# EAGLE design Adafruit OLED 128x32 Mono I2C (EAGLE 6.2)
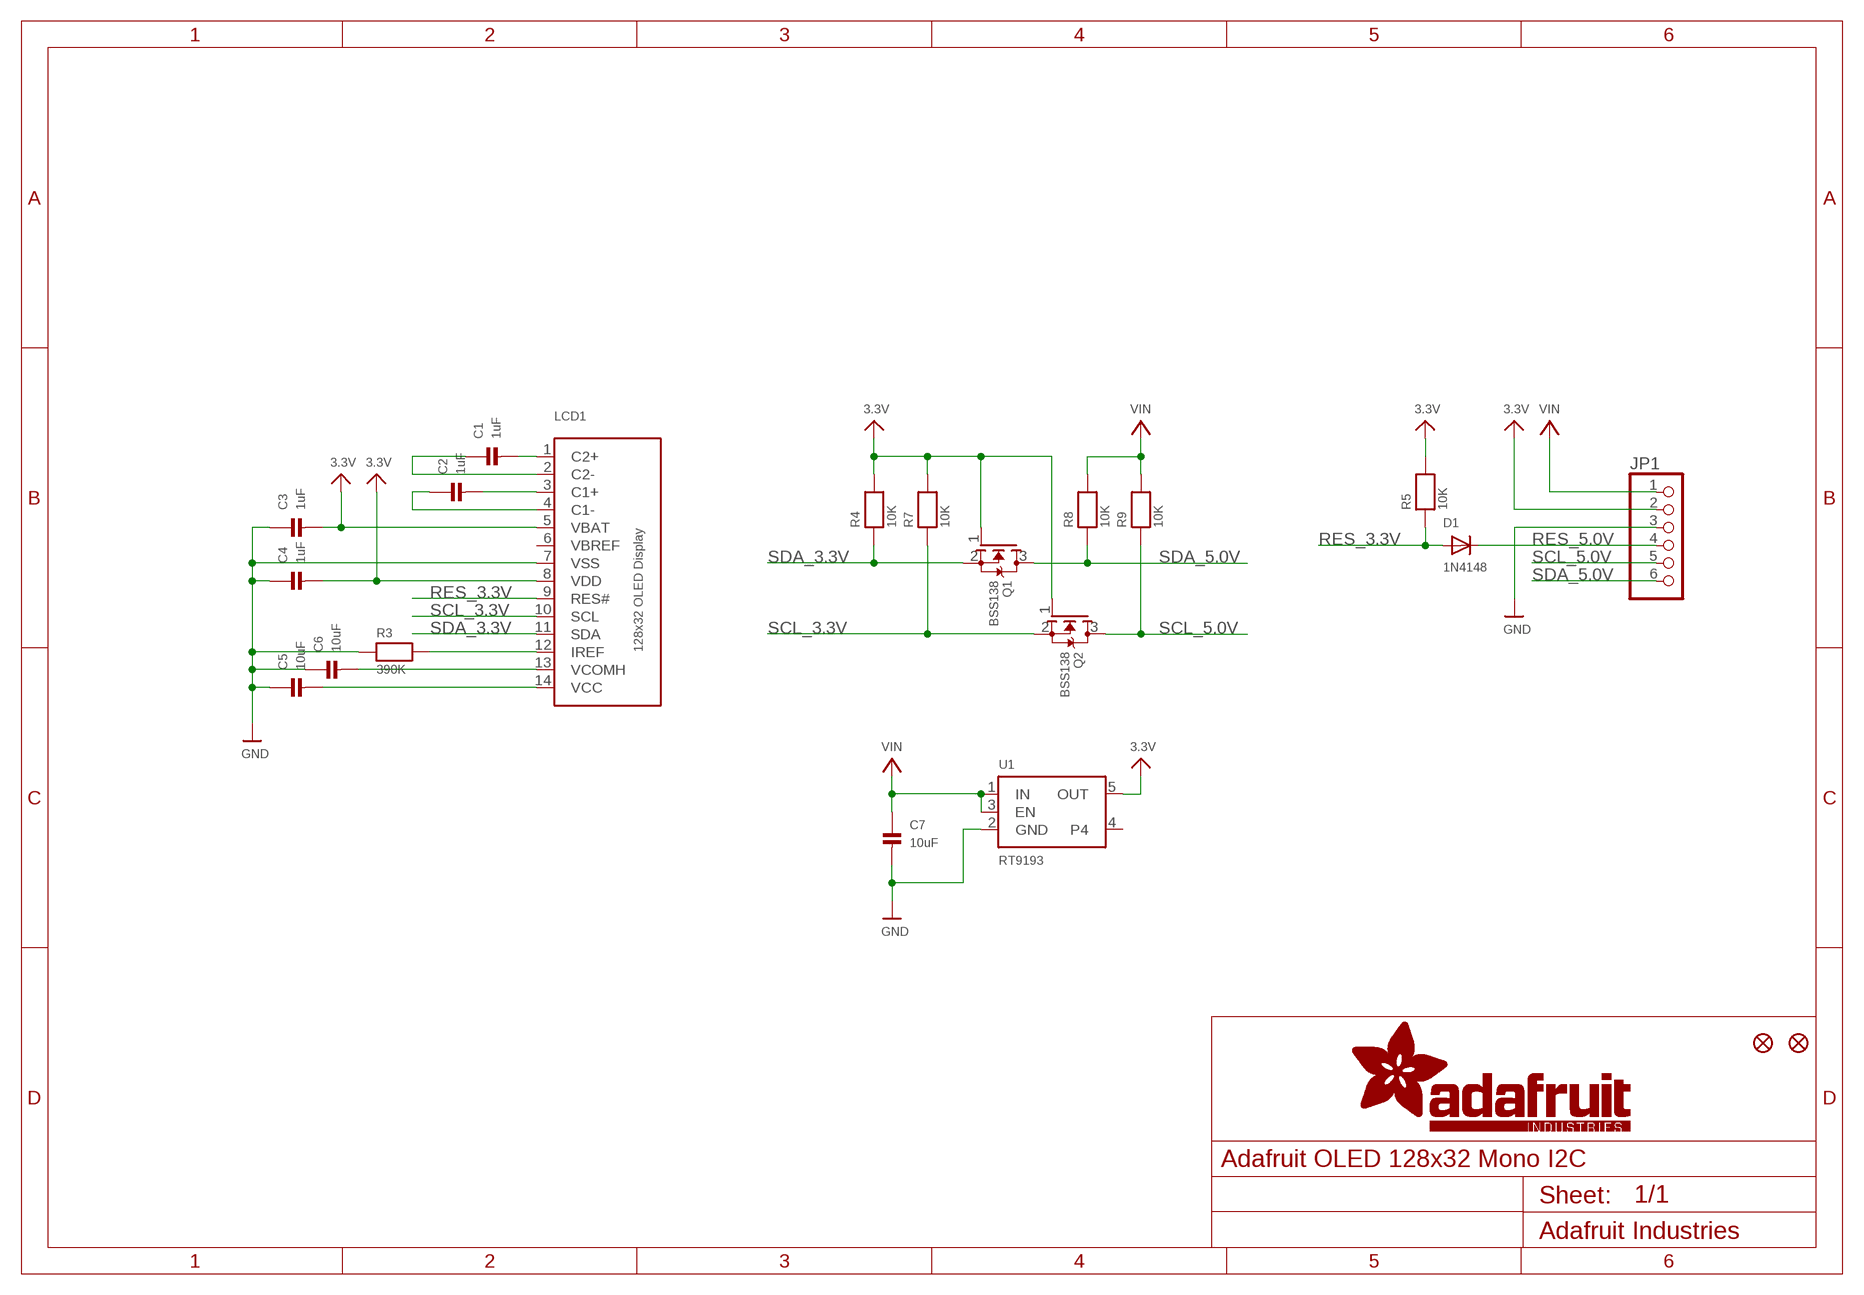
[diagram p0: schematic, sheet 1]

## Parts
C1  1uF  CAP_CERAMIC0805  [0805]
C2  1uF  CAP_CERAMIC0805  [0805]
C3  1uF  CAP_CERAMIC0805  [0805]
C4  1uF  CAP_CERAMIC0805  [0805]
C5  10uF  CAP_CERAMIC0805  [0805]
C6  10uF  CAP_CERAMIC0805  [0805]
C7  10uF  CAP_CERAMIC0805  [0805]
D1  1N4148  DIODESOD-323F  [SOD-323F]
FID1  FIDUCIAL""  [FIDUCIAL_1MM]
FID2  FIDUCIAL""  [FIDUCIAL_1MM]
JP1  HEADER-1X670MIL  [1X06_ROUND_70]
LCD1  DISP_OLED_UG-2832HSWEG02  [UG-2832HSWEG02_WRAPUNDER]
Q1  BSS138  MOSFET-NWIDE  [SOT23-WIDE]
Q2  BSS138  MOSFET-NWIDE  [SOT23-WIDE]
R3  390K  RESISTOR0805  [0805]
R4  10K  RESISTOR0805  [0805]
R5  10K  RESISTOR0805  [0805]
R7  10K  RESISTOR0805  [0805]
R8  10K  RESISTOR0805  [0805]
R9  10K  RESISTOR0805  [0805]
U1  RT9193  VREG_SOT23-5  [SOT23-5]

## Nets
3.3V: C3.2 C4.2 JP1.2 LCD1.5(VBAT) LCD1.8(VDD) Q1.1(G) Q2.1(G) R4.2 R5.2 R7.2 U1.5(OUT)
GND: C3.1 C4.1 C5.1 C6.1 C7.2 JP1.3 LCD1.7(VSS) R3.1 U1.2(GND)
N$1: C1.2 LCD1.1(C2+)
N$2: C1.1 LCD1.2(C2-)
N$3: C2.2 LCD1.3(C1+)
N$4: C2.1 LCD1.4(C1-)
N$5: C6.2 LCD1.13(VCOMH)
N$6: C5.2 LCD1.14(VCC)
N$7: LCD1.12(IREF) R3.2
RES_3.3V: D1.A LCD1.9(RES#) R5.1
RES_5.0V: D1.C JP1.4
SCL_3.3V: LCD1.10(SCL) Q2.2(S) R7.1
SCL_5.0V: JP1.5 Q2.3(D) R9.1
SDA_3.3V: LCD1.11(SDA) Q1.2(S) R4.1
SDA_5.0V: JP1.6 Q1.3(D) R8.1
VIN: C7.1 JP1.1 R8.2 R9.2 U1.1(IN) U1.3(EN)
Unconnected: U1.4

## Power pins joined to a net without a drawn wire
VBREF: LCD1.6(VBREF)

## Library data of the parts
C1-C7 = microbuilder:CAP_CERAMIC: Ceramic Capacitors 0402 - 0402 Surface Mount Capacitors 16pF 50V 5% [Digikey: 445-4899-2-ND] 18pF 50V 5% [Digikey: 490-1281-2-ND] 22pF 50V 5% [Digikey: 490-1283-2-ND] 68pF 50V 5% [Digikey: 490-1289-2-ND] 0.1uF 10V 10% [Digikey: 490-1318-2-ND] 1.0uF 6.3V 10% [Digikey: 490-1320-2-ND] 0603 - 0603 Surface Mount Capacitors 16 pF 50V 5% [Digikey: 445-5051-2-ND] 22 pF 50V [Digikey: PCC220ACVTR-ND] 33 pF 50V 5% [Digikey: 490-1415-1-ND] 56pF 50V 5% [Digikey: 490-1421-1-ND] 220pF 50V 5% [Digikey: 445-1285-1-ND] 680 pF 50V 2200 pF 50V 5% C0G [Digikey: 445-1297-1-ND] 5600 pF 100V 5% X7R [Digikey: 478-3711-1-ND] 0.1 µF 25V 10% [Digikey: PCC2277TR-ND] 0.22 µF 16V 10% X7R [Digikey: 445-1318-1-ND] 1.0 µF 25V 10% [Digikey: 445-5146-2-ND] 0603 - RF Specific 3pF 250V +/-0.1pF RF [Digikey: 712-1347-1-ND] 18 pF 250V 5% [Digikey: 478-3505-1-ND or 712-1322-1-ND] 56 pF 250V 5% C0G RF [Digikey: 490-4867-1-ND] 68 pF 250V RF [Digikey: 490-4868-1-ND] 0805 - 0805 Surface Mount Capacitors 220 pF 250V 2% RF Ceramic Capacitor [Digikey: 712-1398-1-ND] 1000 pF 50V 2% NP0 Ceramic Capacitor [Digikey: 478-3760-1-ND] 0.1 µF 25V 10% Ceramic Capacitor [Digikey: PCC1828TR-ND] 1.0 µF 16V 10% Ceramic Capacitor[Digikey: 490-1691-2-ND] 10.0 µF 10V 10% Ceramic Capacitor[Digikey: 709-1228-1-ND] 10.0 uF 16V 10% Ceramic Capacitor [Digikey: 478-5165-2-ND] 47 uF 6.3V 20% Ceramic Capacitor [Digikey: 587-1779-1-ND or 399-5506-1-ND] 1206 - 1206 Surface Mount Capacitors 47uF 10V 20% Ceramic Capacitor [Digikey: 490-5528-1-ND or 399-5508-1-ND or 445-6010-1-ND] 100uF 6.3V -20%, +80% Y5V Ceramic Capacitor (Digikey: 490-4512-1-ND, Mouser: 81-GRM31CF50J107ZE1L)
D1 = adafruit:DIODE: Diode SMADIODE - SMA Surface Mount Package 20V 1A Schottky Diode Digikey: 641-1014-6-ND DO-1N4148 - Through Hole Small Current Diode SOD-123 20V 1 A (.5mV Vf) Schottky Diode - Digikey: MBRX120TPMSCT-ND SOD-323 10V 570mA (.38mV Vf, 3ns) Schottky Diode - Digikey: ZLLS410CT-ND SOD-523 30V 30mA Schottky Diode (RB751S-40TE61) - Digikey: RB751S-40TE61CT-ND SOT23-R/W - SOT23 Package (R = Solder Paste/Reflow Ovens, W = Hand-Soldering) BAT54Film 40V 300mA - Digikey: 497-7162-1-ND
FID1 FID2 = microbuilder:FIDUCIAL: Fiducial Alignment Points Various fiducial points for machine vision alignment.
JP1 = microbuilder:HEADER-1X6: PIN HEADER
LCD1 = microbuilder:DISP_OLED_UG-2832HSWEG02: 128x32 I2C 0.91" Monochrome OLED Display
Q1 Q2 = microbuilder:MOSFET-N: N-Channel Mosfet LEGEND VDS: Voltage Drain-Source ID: Drain Current RDS(ON): Drain-Source On-State Resistance VGS(TH): Gate-Source Threshold Voltage CISS: Drain-Source Input Capacitance SOT-23 Name VDS ID RDS(ON) VGS(TH) CISS Order Number 2N7002E 60V 260mA 2.5 Ohm 2.5V @ 250uA 26.7pF @ 25V 2N7002ET1GOSTR-ND BSH103 30V 850mA 400 mOhm 400mV @ 1mA 83pF @ 24V BSH103,235-ND BSS138 60V 320mA 1.6 Ohm 1.5V @ 250uA 50pF @ 10V Mouser: 771-BSS138PW115 * BSS138 good choice for I2C level-shifting
R3-R5 R7-R9 = microbuilder:RESISTOR: Resistors 0402 - 0402 Surface Mount Package 22 Ohm 1% 1/16W [Digikey: 311-22.0LRTR-ND] 33 Ohm 5% 1/16W 1.0K 5% 1/16W 1.5K 5% 1/16W 2.0K 1% 1/16W 10.0K 1% 1/16W [Digikey: 311-10.0KLRTR-ND] 10.0K 5% 1/16W [Digikey: RMCF0402JT10K0TR-ND] 12.1K 1% 1/16W [Digikey: 311-22.0LRTR-ND] 100.0K 5% 1/16W 0603 - 0603 Surface Mount Package 0 Ohm 1/10 Watt 1% Resistor 15 Ohm 1/10 Watt 1% Resistor 33 Ohm 1/10 Watt 1% Resistor 49.9 Ohm 1/10 Watt 1% Resistor 100 Ohm 1/10 Watt 1% Resistor 150 Ohm 1/10 Watt 1% Resistor 240 Ohm 1/10 Watt 1% Resistor 390 Ohm 1/10 Watt 1% Resistor 560 Ohm 1/10 Watt 1% Resistor 680 Ohm 1/10 Watt 1% Resistor 750 Ohm 1/10 Watt 1% Resistor 1.0K Ohm 1/10 Watt 1% Resistor 1.5K Ohm 1/10 Watt 1% Resistor 2.0K Ohm 1/10 Watt 1% Resistor 2.2K Ohm 1/10 Watt 1% Resistor 3.3K Ohm 1/10 Watt 1% Resistor 4.7K Ohm 1/10 Watt 1% Resistor 10.0K Ohm 1/10 Watt 1% Resistor 12.0K Ohm 1/10 Watt 1% Resistor 12.1K Ohm 1/10 Watt 1% Resistor 20.0K Ohm 1/10 Watt 1% Resistor 33.0K Ohm 1/10 Watt 1% Resistor 100.0K Ohm 1/10 Watt 1% Resistor 0805 - 0805 Surface Mount Package 0 Ohm 1/8 Watt 1% Resistor 33 Ohm 1/8 Watt 1% Resistor 100 Ohm 1/8 Watt 1% Resistor 150 Ohm 1/8 Watt 1% Resistor 200 Ohm 1/8 Watt 1% Resistor 240 Ohm 1/8 Watt 1% Resistor 330 Ohm 1/8 Watt 1% Resistor 390 Ohm 1/8 Watt 1% Resistor 470 Ohm 1/8 Watt 1% Resistor 1.0K Ohm 1/8 Watt 1% Resistor 1.5K Ohm 1/8 Watt 1% Resistor 2.0K Ohm 1/8 Watt 1% Resistor 4.7K Ohm 1/8 Watt 1% Resistor 5.1K Ohm 1/8 Watt 1% Resistor 5.6K Ohm 1/8 Watt 1% Resistor 10.0K Ohm 1/8 Watt 1% Resistor 22.0K Ohm 1/8 Watt 1% Resistor 33.0K Ohm 1/8 Watt 1% Resistor 100K Ohm 1/8 Watt 1% Resistor 1206 - 1206 Surface Mount Package 2012 - 2010 Surface Mount Package 0.11 Ohm 1/2 Watt 1% Resistor - Digikey: RHM.11UCT-ND
U1 = microbuilder:VREG_SOT23-5: SOT23-5 Fixed Voltage Regulators To better organise some of the SOT23-5 fixed voltage regulators in this library, this new part was created. Part Current Out V Out V In V Dropout Digikey Part No. ADP121 150mA 3.3V 3.4-5.5V 0.09V @ 150mA ADP121-AUJZ33R7CT-ND ADP121 150mA 3.0V 3.1-5.5V 0.09V @ 150mA ADP121-AUJZ30R7CT-ND ADP122 300mA 3.3V 3.4-5.5V 0.085V @ 300mA ADP122AUJZ-3.3-R7CT-ND ADP1712 300mA 3.3V 3.5-5.5V 0.17V @ 300mA ADP1712AUJZ-3.3-R7TR-ND AP7311 (Low Cost) 150mA 3.3V 3.5-6V 0.15V @ 150mA AP7311-33WG-7DICT-ND LD39015M18R 150mA 1.8V 1.9V-5.5V 0.08V @ 100mA 497-6977-1-ND MCP1824T-3302E/OT 300mA 3.3V 3.5V-6V 0.2V @ 300mA MCP1824T-3302E/OTCT-ND MIC5205-2.5YM5 TR 150mA 2.5V 2.7-16V 0.165V @ 150mA 576-1257-2-ND MIC5205-3.0YM5 TR 150mA 3.0V 3.2V-16V 0.165V @ 150mA 576-1258-2-ND MIC5205-3.3YM5 TR 150mA 3.3V 3.5V-16V 0.165V @ 150mA 576-1259-2-ND TPS780330220 150mA 3.3V+2.2V 3.6-5.5V 250mV Max 296-23332-1-ND TDA3663/N1,135 100mA 3.3V 3.5-45V 0.18V @ 50mA 568-5343-1-ND

## Board
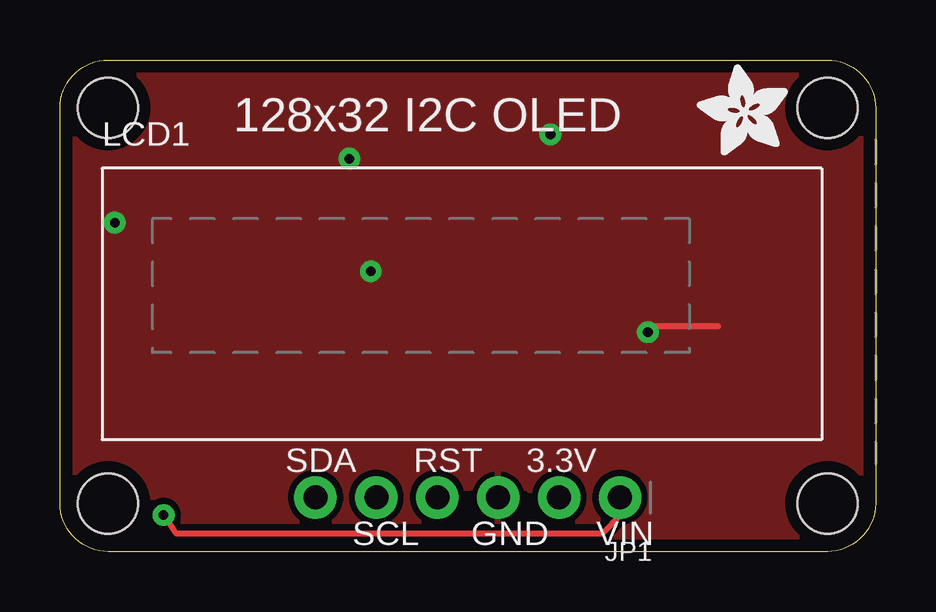
[diagram p1: board, top side]
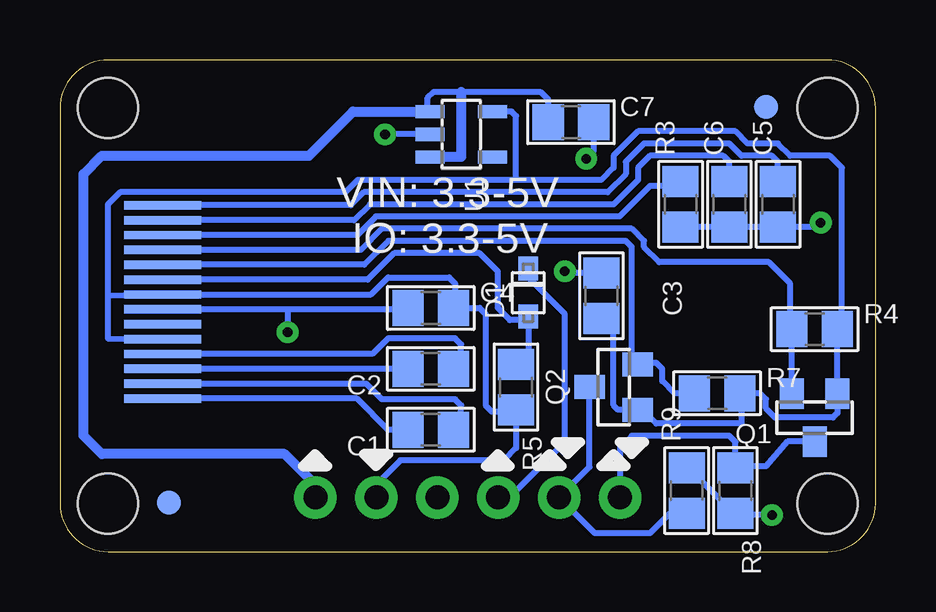
[diagram p2: board, bottom side, seen from below]

Size 34 x 20.5 mm. Coordinates in mm from the lower left corner, seen from the top.
Outline: 0,2 0,18.5 arc-90 2,20.5 32,20.5 arc-90 34,18.5 34,2 arc-90 32,0 2,0 arc-90 0,2
Copper layers (1*16): Top 0.035mm / dielectric 1.5mm / Bottom 0.035mm
Design rules: minimum track width 8mil, minimum drill 0.4mm, track to track 8mil, track to pad 8mil, pad to pad 8mil, via to via 8mil, smd to smd 8mil, copper to edge 20mil, drill to drill 8mil, minimum pad ring 8mil, minimum via ring 10mil, stop-mask expansion 3mil, vias tented up to drill 20mil, thermal gap 8mil
Holes 2.5 mm at 2,2 2,18.5 32,18.5 32,2
tRestrict: area 17.1,1.7 to 17.3,2.3; area 19.2,1.8 to 19.3,2.3

### Footprints (pad centres in the part's own frame; a part is rotated, then mirrored left to right if it is on the bottom)
0805 = smd 1.3 x 1.5: 1 -0.95,0; 2 0.95,0
SOD-323F = smd 1 x 0.8: A -1,0; C 1,0
FIDUCIAL_1MM = smd 1 x 1: 1 0,0
1X06_ROUND_70 = drill 1 pad 1.778: 1 -6.35,0; 2 -3.81,0; 3 -1.27,0; 4 1.27,0; 5 3.81,0; 6 6.35,0
UG-2832HSWEG02_WRAPUNDER = smd 3.2 x 0.35 bottom: 1 -2.03,-4.03; 2 -2.03,-3.41; 3 -2.03,-2.79; 4 -2.03,-2.17; 5 -2.03,-1.55; 6 -2.03,-0.93; 7 -2.03,-0.31; 8 -2.03,0.31; 9 -2.03,0.93; 10 -2.03,1.55; 11 -2.03,2.17; 12 -2.03,2.79; 13 -2.03,3.41; 14 -2.03,4.03
SOT23-WIDE = smd 1 x 1.27: 1 -0.95,-1; 2 0.95,-1; 3 0,1
SOT23-5 = smd 0.55 x 1.2: 1 -0.95,-1.3; 2 0,-1.3; 3 0.95,-1.3; 4 0.95,1.3; 5 -0.95,1.3

### Placement (x,y rotation side)
C1  18.54,5.08 180 bottom
C2  18.54,7.62 180 bottom
C3  11.43,10.67 270 bottom
C4  18.54,10.16 0 bottom
C5  4.06,14.48 90 bottom
C6  6.1,14.48 90 bottom
C7  12.7,17.91 0 bottom
D1  14.48,10.79 90 bottom
FID1  4.57,18.54 0 bottom
FID2  29.46,2.03 0 bottom
JP1  17,2.25 180 top
LCD1  31.75,10.41 0 top
Q1  2.54,5.59 180 bottom
Q2  10.92,6.86 90 bottom
R3  8.13,14.48 90 bottom
R4  2.54,9.27 0 bottom
R5  14.99,6.86 270 bottom
R7  6.6,6.6 0 bottom
R8  5.84,2.54 270 bottom
R9  7.87,2.54 90 bottom
U1  17.27,17.4 270 bottom
U$16  [ADAFRUIT_3.5MM]  30.35,16.51 90 top

### Tracks (layer width: path | path; a pad name or v marks a point on that pad's centre or on a via)
3.3V
  Bottom 0.254: 5.59,6.79 5.59,5.33 9.14,5.33 9.72,5.91 Q2.1 10.73,5.91 10.92,6.1 10.92,9.21 C3.2 | 5.59,6.79 R7.2 4.83,6.6 4.57,6.35 4.57,5.97 4.19,5.59 1.78,5.59 1.59,5.78 Q1.1 R4.2 1.59,8.7 1.4,8.89 1.4,16 1.91,16.51 3.56,16.51 4.06,17.02 5.33,17.02 5.84,17.53 9.91,17.53 10.92,16.51 10.92,16 11.43,15.49 14.99,15.49 | JP1.2 20.81,2.81 19.81,3.81 15.49,3.81 14.99,4.32 R5.2 15.05,5.84 16,5.84 16.26,6.1 16.26,9.91 16.51,10.16 C4.2 17.53,10.23 17.53,11.18 17.78,11.43 20.32,11.43 21.03,10.72 LCD1.8 | U1.5 15.17,18.35 14.99,18.16 14.99,15.49 | LCD1.8 28.19,10.72 | 5.59,6.79 5.71,6.79 | 14.99,15.49 21.59,15.49 22.1,14.99 31.5,14.99 32,14.48 32,10.67 | LCD1.5 30.45,8.86 32,8.89 32,10.67 | LCD1.8 30.68,10.72 32,10.67
GND  (via drill 0.4)
  Top 0.254: v2.29,13.72 2.29,13.97 | 27.43,9.4 24.77,9.4 v24.51,9.14
  Bottom 0.254: 19.3,10.1 C4.1 20.07,10.16 20.13,10.1 24.58,10.1 | R3.1 C6.1 C5.1 2.47,13.53 v2.29,13.72 | U1.2 v20.45,17.4 | C3.1 12.89,11.62 v12.95,11.68 | C7.2 11.75,16.7 v12.06,16.38 | 24.26,9.27 24.38,9.14 v24.51,9.14 24.51,10.03 24.58,10.1 | 24.58,10.1 LCD1.7
  pour Top (isolate 0.254): 0,0 0,21 34,21 34,0
N$1
  Bottom 0.254: LCD1.1 21.62,6.38 20.32,5.08 C1.2
N$2
  Bottom 0.254: LCD1.2 21.22,7 20.57,6.35 17.53,6.35 17.27,6.1 17.27,5.15 C1.1
N$3
  Bottom 0.254: C2.2 LCD1.3
N$4
  Bottom 0.254: LCD1.4 20.97,8.24 20.32,8.89 17.53,8.89 17.27,8.64 17.27,7.69 C2.1
N$5
  Bottom 0.254: LCD1.13 21.74,13.82 21.08,14.48 10.92,14.48 9.91,15.49 9.91,16 9.4,16.51 6.35,16.51 6.1,16.26 C6.2
N$6
  Bottom 0.254: LCD1.14 21.88,14.44 21.34,14.99 11.18,14.99 10.41,15.75 10.41,16.26 9.65,17.02 6.1,17.02 5.59,16.51 4.32,16.51 4.06,16.26 C5.2
N$7
  Bottom 0.254: LCD1.12 21.6,13.2 20.83,13.97 10.67,13.97 9.4,15.24 8.32,15.24 R3.2
RES_3.3V
  Bottom 0.254: LCD1.9 21.17,11.34 20.07,12.45 16.51,12.45 15.75,11.68 15.75,10.16 15.24,9.65 14.56,9.65 D1.A 14.48,8.32 R5.1
RES_5.0V
  Bottom 0.254: JP1.4 15.53,2 12.95,4.57 12.95,9.91 14.48,11.43 D1.C 14.39,11.68
SCL_3.3V
  Bottom 0.254: LCD1.10 21.31,11.96 20.32,12.95 10.41,12.95 10.16,12.7 10.16,10.92 10.16,8.05 Q2.2 9.86,7.87 9.14,7.87 8.89,7.62 8.89,7.11 8.38,6.6 R7.1
SCL_5.0V
  Bottom 0.254: R9.1 8.57,1.59 9.4,0.76 11.7,0.76 JP1.5 11.92,3.52 Q2.3
SDA_3.3V
  Bottom 0.254: Q1.2 R4.1 3.56,8.7 3.56,11.18 4.45,12.06 9.02,12.06 9.65,12.7 9.65,12.95 10.16,13.46 20.57,13.46 21.46,12.58 LCD1.11
SDA_5.0V
  Bottom 0.254: JP1.6 10.65,4.34 10.16,4.83 6.1,4.83 5.84,4.57 R8.1 5.78,3.56 4.57,3.56 3.67,4.59 Q1.3
VIN  (via drill 0.4)
  Top 0.254: JP1.1 23.35,1.51 22.61,0.76 4.83,0.76 v4.32,1.52
  Bottom 0.254: R9.2 7.43,3.05 7.37,3.05 5.91,1.59 R8.2 5.78,1.52 v4.32,1.52 | C7.1 13.65,18.86 13.97,19.18 17.27,19.18 18.41,19.18 18.67,18.92 18.67,18.45 U1.1
  Bottom 0.406: U1.1 21.78,18.35 23.62,16.51 32.26,16.51 33.02,15.75 33.02,4.83 32.26,4.06 24.64,4.06 23.24,2.67 23.24,2.11 JP1.1 | U1.3 17.27,16.45 17.27,19.18

### Text on the board
tPlace: 128x32 I2C OLED | SDA | RST | 3.3V | SCL | GND | VIN
bPlace: VIN: 3.3-5V | IO: 3.3-5V
bDocu: adafruit!